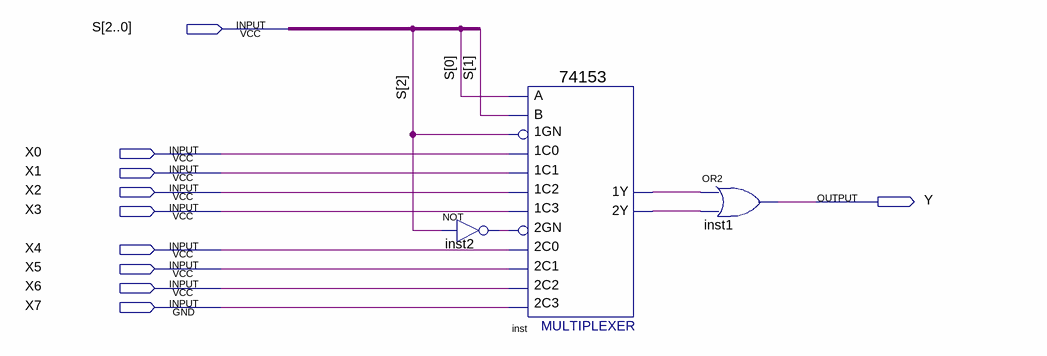
[diagram p0: schematic sheet]
// Quartus schematic exercicio.bdf as structural Verilog: 3 symbols, 10 pins
module exercicio (
  input  [2:0] S,
  input  X0,
  input  X1,
  input  X2,
  input  X3,
  input  X4,
  input  X5,
  input  X6,
  input  X7,
  output Y
);

  wire inst2_out, inst_1y, inst_2y;

  not inst2 (inst2_out, S[2]);
  \74153  inst (
    .\1C1 (X1), .\1GN (S[2]), .\1C0 (X0), .\2C0 (X4), .\2GN (inst2_out), .\2C2 (X6), .\1C2 (X2), .\1C3 (X3),
    .B(S[1]), .A(S[0]), .\2C1 (X5), .\2C3 (X7), .\1Y (inst_1y), .\2Y (inst_2y));
  or inst1 (Y, inst_1y, inst_2y);
endmodule
